# Altium schematic sheet PROC106B_PMIC.SchDoc: PMIC
size 431 x 279 mm; Date: Not shown in title block; ApprovedBy: Not shown in title block; CheckedBy: Not shown in title block; Author: Not shown in title block; CompanyName: Not shown in title block; DrawnBy: Antony/Anand Ram; Engineer: Not shown in title block; Organization: Not shown in title block; Address1: Not shown in title block; Address2: Not shown in title block; Address3: Not shown in title block; Address4: Not shown in title block; DocumentNumber: 5; Revision: Use project parameter SCH_Rev; SheetNumber: 5; SheetTotal: 12; PageSetup: Record=PageOptions|CenterHorizontal=True|CenterVertical=True|PrintScale=1.00|XCorrection=1.00|YCorrection=1.00|PrintKind=0|BorderSize=5000000|LeftOffset=0|BottomOffset=0|Orientation=2|PaperLength=1000|PaperWidth=1000|Scale=100|PaperSource=15|PrintQuality=600|MediaType=1|DitherType=10|PaperKind=Letter|PrintScaleMode=1; CurrentTime: Not shown in title block; CurrentDate: Not shown in title block; Time: Not shown in title block; DocumentFullPathAndName: Not shown in title block; DocumentName: Not shown in title block; ModifiedDate: Not shown in title block; ImagePath: Not shown in title block
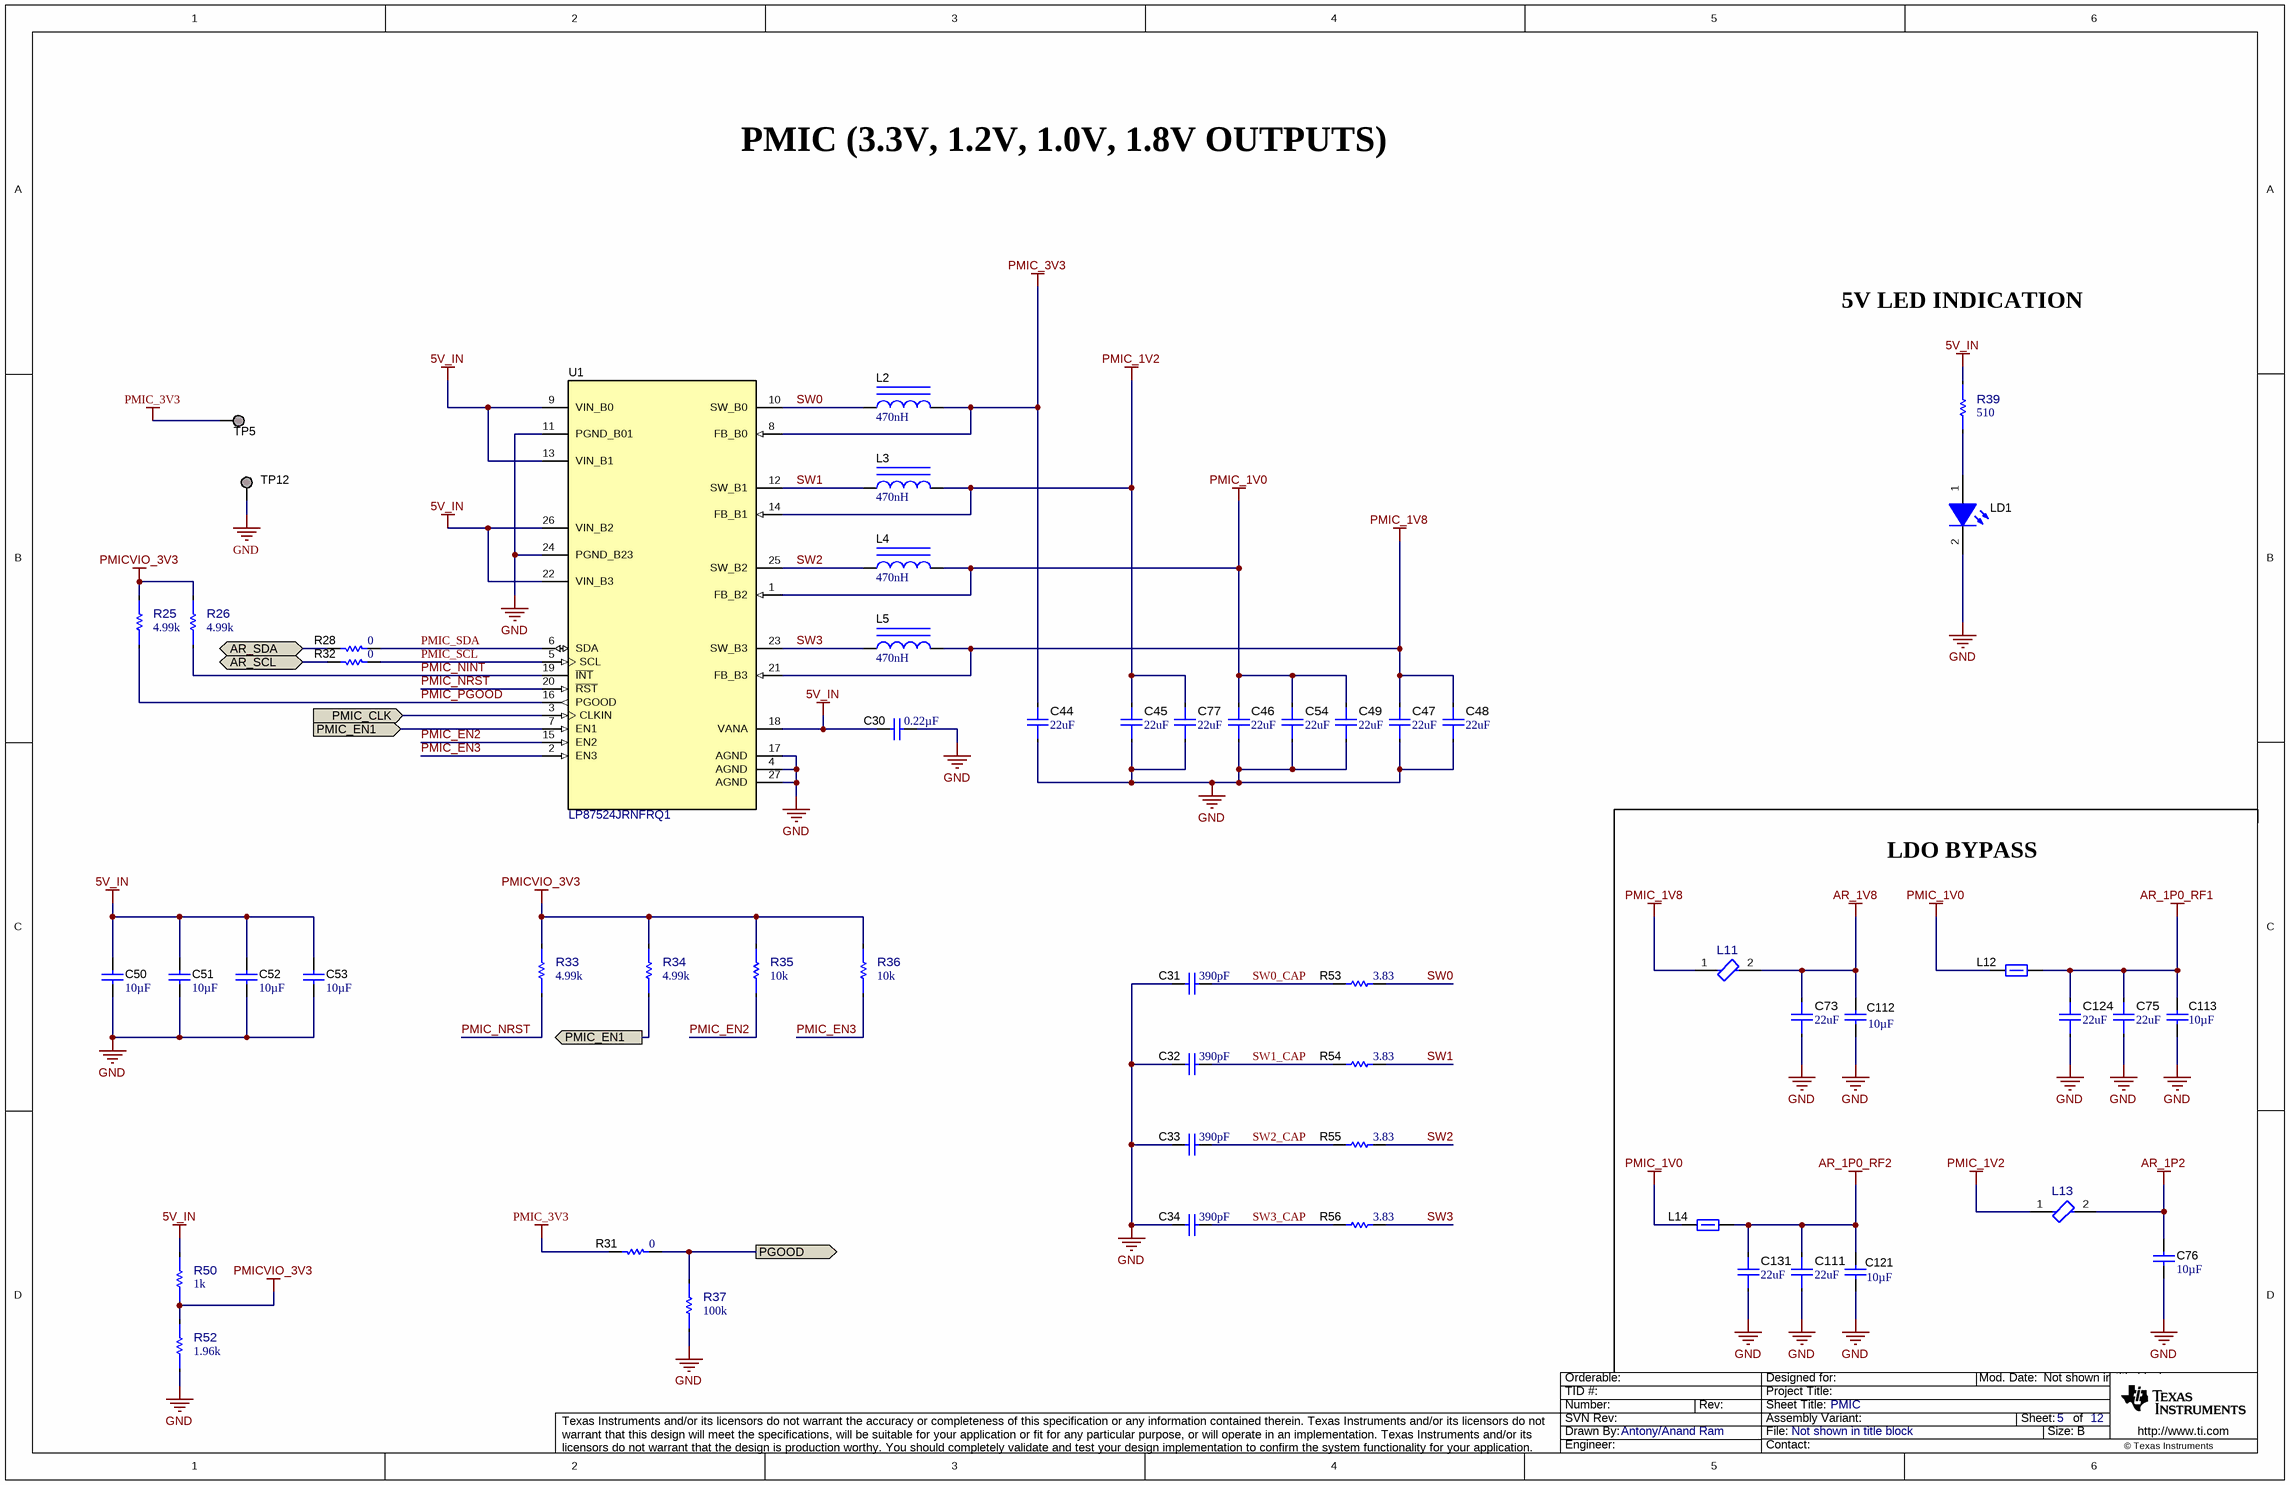
[diagram p0: PROC106B_PMIC.SchDoc]

## Parts
C30  ValueDisplayed: 0.22µF  [0402L]  (hidden comment: GCM155R71C224KE02D)
C31  ValueDisplayed: 390pF  [0402L]  (hidden comment: CGA2B2C0G1H391J050BA)
C32  ValueDisplayed: 390pF  [0402L]  (hidden comment: CGA2B2C0G1H391J050BA)
C33  ValueDisplayed: 390pF  [0402L]  (hidden comment: CGA2B2C0G1H391J050BA)
C34  ValueDisplayed: 390pF  [0402L]  (hidden comment: CGA2B2C0G1H391J050BA)
C44  ValueDisplayed: 22uF  [FP-CGA4J1X7T0J226M125AC_0805-MFG]  (hidden comment: CGA4J1X7T0J226M125AC)
C45  ValueDisplayed: 22uF  [FP-CGA4J1X7T0J226M125AC_0805-MFG]  (hidden comment: CGA4J1X7T0J226M125AC)
C46  ValueDisplayed: 22uF  [FP-CGA4J1X7T0J226M125AC_0805-MFG]  (hidden comment: CGA4J1X7T0J226M125AC)
C47  ValueDisplayed: 22uF  [FP-CGA4J1X7T0J226M125AC_0805-MFG]  (hidden comment: CGA4J1X7T0J226M125AC)
C48  ValueDisplayed: 22uF  [FP-CGA4J1X7T0J226M125AC_0805-MFG]  (hidden comment: CGA4J1X7T0J226M125AC)
C49  ValueDisplayed: 22uF  [FP-CGA4J1X7T0J226M125AC_0805-MFG]  (hidden comment: CGA4J1X7T0J226M125AC)
C50  Cap_F: 10µF  [0805_HV1]  (hidden comment: GCM21BR71A106KE22L)
C51  Cap_F: 10µF  [0805_HV1]  (hidden comment: GCM21BR71A106KE22L)
C52  Cap_F: 10µF  [0805_HV1]  (hidden comment: GCM21BR71A106KE22L)
C53  Cap_F: 10µF  [0805_HV1]  (hidden comment: GCM21BR71A106KE22L)
C54  ValueDisplayed: 22uF  [FP-CGA4J1X7T0J226M125AC_0805-MFG]  (hidden comment: CGA4J1X7T0J226M125AC)
C73  ValueDisplayed: 22uF  [FP-CGA4J1X7T0J226M125AC_0805-MFG]  (hidden comment: CGA4J1X7T0J226M125AC)
C75  ValueDisplayed: 22uF  [FP-CGA4J1X7T0J226M125AC_0805-MFG]  (hidden comment: CGA4J1X7T0J226M125AC)
C76  Cap_F: 10µF  [0805L]  (hidden comment: GCM21BR71A106KE22L)
C77  ValueDisplayed: 22uF  [FP-CGA4J1X7T0J226M125AC_0805-MFG]  (hidden comment: CGA4J1X7T0J226M125AC)
C111  ValueDisplayed: 22uF  [FP-CGA4J1X7T0J226M125AC_0805-MFG]  (hidden comment: CGA4J1X7T0J226M125AC)
C112  Cap_F: 10µF  [0805L]  (hidden comment: GCM21BR71A106KE22L)
C113  Cap_F: 10µF  [0805L]  (hidden comment: GCM21BR71A106KE22L)
C121  Cap_F: 10µF  [0805L]  (hidden comment: GCM21BR71A106KE22L)
C124  ValueDisplayed: 22uF  [FP-CGA4J1X7T0J226M125AC_0805-MFG]  (hidden comment: CGA4J1X7T0J226M125AC)
C131  ValueDisplayed: 22uF  [FP-CGA4J1X7T0J226M125AC_0805-MFG]  (hidden comment: CGA4J1X7T0J226M125AC)
L2  ValueDisplayed: 470nH  [DFE252012P]  (hidden comment: DFE252012PD-R47M)
L3  ValueDisplayed: 470nH  [DFE252012P]  (hidden comment: DFE252012PD-R47M)
L4  ValueDisplayed: 470nH  [DFE252012P]  (hidden comment: DFE252012PD-R47M)
L5  ValueDisplayed: 470nH  [DFE252012P]  (hidden comment: DFE252012PD-R47M)
L11  MPZ2012S101ATD25  [FP-MPZ2012S101ATD25_0805-MFG]  (value not drawn)
L12  BLM18KG121TH1D  [0603_HV]  (value not drawn)
L13  MPZ2012S101ATD25  [FP-MPZ2012S101ATD25_0805-MFG]  (value not drawn)
L14  BLM18KG121TH1D  [0603_HV]  (value not drawn)
LD1  APHHS1005CGCK  [APHHS1005_Green]  (value not drawn)
R25  value 4.99k  [FP-ERJ-1GNF4991C_0201-IPC_C]  (hidden comment: ERJ-1GNF4991C)
R26  value 4.99k  [FP-ERJ-1GNF4991C_0201-IPC_C]  (hidden comment: ERJ-1GNF4991C)
R28  ValueDisplayed: 0  [0201L]  (hidden comment: ERJ-1GN0R00C)
R31  ValueDisplayed: 0  [0201L]  (hidden comment: ERJ-1GN0R00C)
R32  ValueDisplayed: 0  [0201L]  (hidden comment: ERJ-1GN0R00C)
R33  value 4.99k  [FP-ERJ-1GNF4991C_0201-IPC_C]  (hidden comment: ERJ-1GNF4991C)
R34  value 4.99k  [FP-ERJ-1GNF4991C_0201-IPC_C]  (hidden comment: ERJ-1GNF4991C)
R35  value 10k  [FP-ERA-1AEB103C_0201-IPC_C]  (hidden comment: ERA-1AEB103C)
R36  value 10k  [FP-ERA-1AEB103C_0201-IPC_C]  (hidden comment: ERA-1AEB103C)
R37  value 100k  [FP-ERJ-1GNF1003C_0201-IPC_C]  (hidden comment: ERJ-1GNF1003C)
R39  value 510  [FP-ERJ-1GNJ511C_0201-IPC_C]  (hidden comment: ERJ-1GNJ511C)
R50  value 1k  [FP-ERJ-1GNJ102C_0201-IPC_C]  (hidden comment: ERJ-1GNJ102C)
R52  value 1.96k  [FP-ERJ-1GNF1961C_0201-IPC_C]  (hidden comment: ERJ-1GNF1961C)
R53  ValueDisplayed: 3.83  [0402L]  (hidden comment: CRCW04023R83FKED)
R54  ValueDisplayed: 3.83  [0402L]  (hidden comment: CRCW04023R83FKED)
R55  ValueDisplayed: 3.83  [0402L]  (hidden comment: CRCW04023R83FKED)
R56  ValueDisplayed: 3.83  [0402L]  (hidden comment: CRCW04023R83FKED)
TP5  TESTPOINT  [TP_25MIL-SMT]  (value not drawn)  (no BOM)
TP12  TESTPOINT  [TP_VIA_060RND040]  (value not drawn)  (no BOM)
U1  LP87524JRNFRQ1  [RNF0026C]

## Ports
AR_SCL (bidir), AR_SDA (bidir), PGOOD (out), PMIC_CLK (in), PMIC_EN1 (in), PMIC_EN1 (out)

## Nets
5V_IN: C30.1 C50.1 C51.1 C52.1 C53.1 R39.1 R50.2 U1.9(VIN_B0) U1.13(VIN_B1) U1.18(VANA) U1.22(VIN_B3) U1.26(VIN_B2)
AR_1P0_RF1: C75.2 C113.1 C124.2 L12.2
AR_1P0_RF2: C111.2 C121.1 C131.2 L14.2
AR_1P2: C76.1 L13.2
AR_1V8: C73.2 C112.1 L11.2
GND: C30.2 C31.2 C32.2 C33.1 C34.1 C44.1 C45.1 C46.1 C47.1 C48.1 C49.1 C50.2 C51.2 C52.2 C53.2 C54.1 C73.1 C75.1 C76.2 C77.1 C111.1 C112.2 C113.2 C121.2 C124.1 C131.1 LD1.2(K) R37.1 R52.1 TP12.1 U1.4(AGND) U1.11(PGND_B01) U1.17(AGND) U1.24(PGND_B23) U1.27(AGND)
PMIC_1V0: C46.2 C49.2 C54.2 L4.1 L12.1 L14.1 U1.1(FB_B2)
PMIC_1V2: C45.2 C77.2 L3.1 L13.1 U1.14(FB_B1)
PMIC_1V8: C47.2 C48.2 L5.1 L11.1 U1.21(FB_B3)
PMIC_3V3: C44.2 L2.1 R31.1 TP5.1 U1.8(FB_B0)
PMICVIO_3V3: R25.2 R26.2 R33.2 R34.2 R35.2 R36.2 R50.1 R52.2
AR_SCL: R32.1 ; port AR_SCL
AR_SDA: R28.1 ; port AR_SDA
PGOOD: R31.2 R37.2 ; port PGOOD
PMIC_CLK: U1.3(CLKIN) ; port PMIC_CLK
PMIC_EN1: R34.1 U1.7(EN1) ; port PMIC_EN1
PMIC_EN2: R35.1 U1.15(EN2)
PMIC_EN3: R36.1 U1.2(EN3)
PMIC_NINT: R26.1 U1.19(~{INT})
PMIC_NRST: R33.1 U1.20(~{RST})
PMIC_PGOOD: R25.1 U1.16(PGOOD)
PMIC_SCL: R32.2 U1.5(SCL)
PMIC_SDA: R28.2 U1.6(SDA)
SW0: L2.2 R53.2 U1.10(SW_B0)
SW0_CAP: C31.1 R53.1
SW1: L3.2 R54.2 U1.12(SW_B1)
SW1_CAP: C32.1 R54.1
SW2: L4.2 R55.2 U1.25(SW_B2)
SW2_CAP: C33.2 R55.1
SW3: L5.2 R56.2 U1.23(SW_B3)
SW3_CAP: C34.2 R56.1
NetLD1_1: LD1.1(A) R39.2

## Notes on the sheet
- PMIC (3.3V, 1.2V, 1.0V, 1.8V OUTPUTS)
- 5V LED INDICATION
- LDO BYPASS
- Drawn By:
- SVN Rev:
- Number:
- TID #:
- Orderable:
- Rev:
- Sheet Title:
- File:
- Project Title:
- Designed for:
- Assembly Variant:
- Mod. Date:
- Sheet:
- Size:
- of
- B
- http://www.ti.com
- Texas Instruments and/or its licensors do not warrant the accuracy or completeness of this specification or any information contained therein. Texas Instruments and/or its licensors do not warrant that this design will meet the specifications, will be suitable for your application or fit for any particular purpose, or will operate in an implementation. Texas Instruments and/or its licensors do not warrant that the design is production worthy. You should completely validate and test your design implementation to confirm the system functionality for your application.
- Engineer:
- Contact:
- © Texas Instruments

## Library data of the parts
C30 = CMP-0078265-1: CAP, CERM, 0.22 µF, 16 V,+/- 10%, X7R, AEC-Q200 Grade 1, 0402; Manufacturer: MuRata; Value: 0.22uF; AEC Category: Q200; AEC Grade: 1; AEC Qualified: Y; Cap_Case: 0402; Cap_F: 220nF; Polarized: N; SizeArea_mm2: 0.5; SizeAreaWB_mm2: 3; SizeZ_mm: 0.6; TaMax_C: 125°C; TaMin_C: -55°C; U/M: EA; Value2: 16V; RoHS: Y; ComponentLink1Description: Datasheet link; ComponentLink1URL: http://psearch.en.murata.com/capacitor/product/GCM155R71C224KE02%23.pdf; CompType: Capacitor; MountType: SMT; PackageReference: 0402; PartNumber: GCM155R71C224KE02D; SizeX_mm: 1; SizeY_mm: 0.5; Supplier 1: Digi-Key; Supplier 2: Mouser; Supplier Part Number 1: 490-10671-1-ND; Supplier Part Number 2: 81-GCM155R71C224KE2D; Technology: Ceramic; TempCo: X7R; Tolerance_%: 10%; VDC_V: 16V
C31-C34 = CMP-0085511-1: CAP, CERM, 390 pF, 50 V,+/- 5%, C0G/NP0, AEC-Q200 Grade 1, 0402; Manufacturer: TDK; AEC Qualified: Y; SizeZ_mm: 0.6; VDC_V: 50V; AEC Category: Q200; AEC Grade: 1; Cap_Case: 0402; Polarized: N; SizeArea_mm2: 0.5; SizeAreaWB_mm2: 3; TaMax_C: 125°C; TaMin_C: -55°C; U/M: EA; Value: 390pF; RoHS: Y; Cap_F: 390pF; ComponentLink1Description: Datasheet link; ComponentLink1URL: https://product.tdk.com/en/search/capacitor/ceramic/mlcc/info?part_no=CGA2B2C0G1H391J050BA; PackageReference: 0402; PartNumber: CGA2B2C0G1H391J050BA; TempCo: C0G/NP0; Tolerance_%: 5%; CompType: Capacitor; MountType: SMT; SizeX_mm: 1; SizeY_mm: 0.5; Technology: Ceramic; Value2: 50V
C44-C49 C54 C73 C75 C77 C111 C124 C131 = CMP-0091983-1: 22µF ±20% 6.3V Ceramic Capacitor X7T 0805 (2012 Metric); Manufacturer: TDK; AEC Qualified: Yes; AEC Grade: Grade 1; TempCo: +22/-33%; SizeZ_mm: 1.55mm; Value: 22µF; ComponentLink1URL: https://product.tdk.com/en/search/capacitor/ceramic/mlcc/info?part_no=CGA4J1X7T0J226M125AC; VDC_V: 6.3V; Operating Temperature Range: -55°C to +125°C; Tolerance_%: 20%; Cap_F: 22µF; Digikey Part Number: 445-CGA4J1X7T0J226M125ACCT-ND; ComponentLink1Description: Datasheet; PackageReference: 0805; Part Number: CGA4J1X7T0J226M125AC; Temperature Characteristic: X7T; Mouser Part Number: 810-CGA4J1X7T0J226M1; helpURL: https://upverter.com/upn/revision/46804438864a26f0/; Supplier 2: Mouser; Supplier Part Number 1: 445-CGA4J1X7T0J226M125ACCT-ND; datasheet: https://product.tdk.com/en/search/capacitor/ceramic/mlcc/info?part_no=CGA4J1X7T0J226M125AC; Lead Free: Yes; RoHS: TRUE; PartNumber: CGA4J1X7T0J226M125AC; Supplier Part Number 2: 810-CGA4J1X7T0J226M1; Datasheet Path: datasheets/Cap-CGA4J1X7T0J226M125AC.pdf; Supplier 1: Digikey; Digikey Description: AUTOMOTIVE GRADE,0805,X7T,6.3V,2
C50-C53 C76 C112 C113 C121 = CMP-0008017-2: CAP, CERM, 10 uF, 10 V, +/- 10%, X7R, 0805; Manufacturer: MuRata; Value: 10uF; AEC Category: Q200; Cap_Case: 0805; Polarized: N; SizeArea_mm2: 2.5; SizeAreaWB_mm2: 6.75; SizeX_mm: 2; SizeY_mm: 1.25; SizeZ_mm: 1.45; TaMax_C: 125°C; TaMin_C: -55°C; U/M: EA; Value1: Unknown; Value2: 10V; RoHS: Y; AEC Qualified: ?; ComponentLink1Description: Datasheet link; ComponentLink1URL: http://www.murata.com/products/catalog/pdf/c03e.pdf; CompType: Capacitor; MountType: SMT; PackageReference: 0805; PartNumber: GCM21BR71A106KE22L; Supplier 1: Digi-Key; Supplier 2: Newark; Supplier 3: Mouser; Supplier Part Number 1: 490-10674-1-ND; Supplier Part Number 2: 06AC6014; Supplier Part Number 3: 81-GCM21BR71A106KE2L; Technology: Ceramic; TempCo: X7R; Tolerance_%: 10%; ValueDisplayed: 10uF; VDC_V: 10V; LatestRevisionDate: 2017-03-09; Published: 2008-06-19; Publisher: Texas Instruments
L2-L5 = CMP-0058944-1: Inductor, Shielded, 470 nH, 4.7 A, 0.021 ohm, SMD; Manufacturer: MuRata Toko; DCR_ohm: 0.021; Irms: 4.7A @ 40C rise; Isat: 6.1A @ 30% inductance drop; SizeZ_mm: 1.2; AEC Category: Q200; Imax_A: 4.7A; SizeArea_mm2: 5; SizeAreaWB_mm2: 10.5; SizeX_mm: 2.5; SizeY_mm: 2; Value: 470nH; RoHS: Y; AEC Qualified: ?; ComponentLink1Description: Datasheet link; ComponentLink1URL: https://sps06.itg.ti.com/sites/KMS/crossdivteams/altium/docs/ComponentDatasheets/DFE252012PD_Catalouge_20140701 with AEC-Q200.pdf; Ind_H: 470nH; Material: ?; PackageReference: 1008; PartNumber: DFE252012PD-R47M; Technology: Shielded; CompType: Inductor; LatestRevisionDate: 2017-06-02; MountType: SMT; Published: 2008-06-26; Publisher: Texas Instruments; Value1: 0.021 ohm; Value2: 4.7A
L11 L13 = CMP-0089947-1: 100 Ohms @ 100MHz 1 Power Line Ferrite Bead 0805 (2012 Metric) 4A 20mOhm; Manufacturer: TDK; DCR_ohm: 0.02; SizeZ_mm: 1.05mm; AEC Grade: Grade 1; AEC Qualified: Yes; Impedance At Frequency: 100Ω @ 100MHz; Tolerance_%: 25%; ComponentLink1URL: https://product.tdk.com/info/en/catalog/datasheets/beads_automotive_power_mpz2012_en.pdf; Supplier Part Number 2: 810-MPZ2012S101ATD25; Supplier 2: Mouser; RoHS: TRUE; Supplier 1: Digikey; PackageReference: 0805; Imax_A: 4A; PartNumber: MPZ2012S101ATD25; ComponentLink1Description: Datasheet; Supplier Part Number 1: 445-172903-1-ND; datasheet: https://product.tdk.com/info/en/catalog/datasheets/beads_automotive_power_mpz2012_en.pdf; Datasheet Path: datasheets/FBead-MPZ2012S101ATD25.pdf; Digikey Description: FERRITE BEAD 100 OHM 0805 1LN; Digikey Part Number: 445-172903-1-ND; helpURL: https://upverter.com/upn/revision/572b4800072287ce/; Lead Free: Yes; Material: Ferrite; Mouser Description: Ferrite Beads 0805 100ohms@100MHz 4.0A AEC-Q200; Mouser Part Number: 810-MPZ2012S101ATD25; Operating Temperature Range: -55°C to +125°C; Part Number: MPZ2012S101ATD25; Test Frequency: 100MHz
L12 L14 = CMP-0077879-1: Ferrite Bead, 120 ohm @ 100 MHz, 1.9 A, 0603; Manufacturer: MuRata; ZTyp@100MHz_Ohm: 120; SizeAreaWB_mm2: 4.68; DCR_ohm: 0.04; Value1: 0.04 ohm; Value: 120 ohm; Imax_A: 1.9A; SizeZ_mm: 1.0; SizeX_mm: 1.6; SizeY_mm: 0.8; SizeArea_mm2: 1.28; ComponentLink1URL: http://www.murata.com/en-global/products/productdata/8796737273886/QNFA9101.pdf; Supplier Part Number 2: 81-BLM18KG121TH1D; Supplier 2: Mouser; RoHS: Y; MountType: SMT; Supplier 1: Digi-Key; PackageReference: 0603; Value2: 1.9A; CompType: Ferrite Bead; PartNumber: BLM18KG121TH1D; ComponentLink1Description: Datasheet link; Supplier Part Number 1: 490-13261-1-ND; ValueDisplayed: 120 ohm
LD1 = CMP-0067682-2: LED, Green, SMD; Manufacturer: Kingbright; Angle: 120.0; Power_TotalModule: 75mW; SizeZ_mm: 0.6; Vf_V: 2.1V; Vr_V: 5V; Io_A: 20mA; Ir_A: 10µA; SizeArea_mm2: 0.5; SizeAreaWB_mm2: 3.0; SizeX_mm: 1.0; Tjmax_C: 85°C; Value1: 0.075W; RoHS: Y; Color: Green; ComponentLink1Description: Datasheet link; ComponentLink1URL: http://www.kingbrightusa.com/images/catalog/SPEC/APHHS1005CGCK.pdf; PackageReference: 0402; PartNumber: APHHS1005CGCK; CompType: LED; MountType: SMT; SizeY_mm: 0.5; Type: ?; Value2: 2.1V; Value: Green
R25 R26 R33 R34 = CMP-0090497-1: 4.99 kOhms ±1% 0.05W, 1/20W Chip Resistor 0201 (0603 Metric) Automotive AEC-Q200 Thick Film; Manufacturer: Panasonic Electronic Components; AEC Grade: Grade 1; AEC Qualified: Yes; Power_W: 50mW; SizeZ_mm: 0.26mm; TempCo: 200ppm/°C; VDC_V: 25V; RoHS: TRUE; ComponentLink1Description: Datasheet; ComponentLink1URL: https://industrial.panasonic.com/cdbs/www-data/pdf/RDA0000/AOA0000C304.pdf; PackageReference: 0201; PartNumber: ERJ-1GNF4991C; Res_ohm: 4.99k; Supplier 1: Digikey; Supplier 2: Mouser; Supplier Part Number 1: P123046CT-ND; Supplier Part Number 2: 667-ERJ-1GNF4991C; Technology: Thick Film; Tolerance_%: 1%; datasheet: https://industrial.panasonic.com/cdbs/www-data/pdf/RDA0000/AOA0000C304.pdf; Datasheet Path: datasheets/Res-ERJ-1GNF4991C.pdf; Digikey Description: RES SMD 4.99K OHM 1% 1/20W 0201; Digikey Part Number: P123046CT-ND; helpURL: https://upverter.com/upn/revision/2e32c60b077f8dd5/; Lead Free: Yes; Mouser Description: Thick Film Resistors - SMD 0201 4.99Kohm 1% HalogenFree AEC-Q200; Mouser Part Number: 667-ERJ-1GNF4991C; Operating Temperature Range: -55°C to +125°C; Part Number: ERJ-1GNF4991C; Series: ERJ
R28 R31 R32 = CMP-0065361-1: RES, 0, 5%, .05 W, AEC-Q200 Grade 0, 0201; Manufacturer: Panasonic; AEC Qualified: Y; Power_W: 50mW; SizeZ_mm: 0.26; TempCo: ppm/C; AEC Category: Q200; EIA_Code: E24; Green_Lifecycle: Not Set; Green_REACh: Incomplete; SizeArea_mm2: 0.18; SizeX_mm: 0.6; SizeY_mm: 0.3; U/M: EA; Value2: .05W; Value: 0; Value_Code: 0000; RoHS: Y; ComponentLink1Description: Datasheet link; ComponentLink1URL: https://industrial.panasonic.com/cdbs/www-data/pdf/RDA0000/AOA0000C281.pdf; PackageReference: 0201; PartNumber: ERJ-1GN0R00C; Res_ohm: 0; Technology: Thick Film; Tolerance_%: 5%; AEC Grade: 0; CompType: Resistor; Green_EU RoHS-2: Incomplete; Green_EU RoHS: Incomplete; LatestRevisionDate: 2017-06-05; MountType: SMT; Published: 2016-10-14; Publisher: Texas Instruments; Supplier 1: Digi-Key; Supplier 2: Newark; Supplier 3: Mouser; Supplier Part Number 1: P15979CT-ND; Supplier Part Number 2: 51W5934; Supplier Part Number 3: 667-ERJ-1GN0R00C; Value1: 5%
R35 R36 = CMP-0090084-1: RES SMD 10K OHM 0.1% 1/20W 0201; Manufacturer: Panasonic; AEC Qualified: No; Power_W: 50mW; SizeZ_mm: 0.26mm; TempCo: 25ppm/°C; VDC_V: 25V; RoHS: TRUE; ComponentLink1Description: Datasheet; ComponentLink1URL: https://industrial.panasonic.com/cdbs/www-data/pdf/RDM0000/AOA0000C307.pdf; PackageReference: 0201; PartNumber: ERA-1AEB103C; Res_ohm: 10k; Technology: Thin Film; Tolerance_%: 0.1%; datasheet: https://industrial.panasonic.com/cdbs/www-data/pdf/RDM0000/AOA0000C307.pdf; Datasheet Path: datasheets/Res-ERA-1AEB103C.pdf; Digikey Description: RES SMD 10K OHM 0.1% 1/20W 0201; Digikey Part Number: P10KBXCT-ND; helpURL: https://upverter.com/upn/revision/ad75fa42d92ba837/; Lead Free: Yes; Mouser Part Number: 667-ERA-1AEB103C; Operating Temperature Range: -55°C to +155°C; Part Number: ERA-1AEB103C; Series: ERA; Supplier 1: Digikey; Supplier 2: Mouser; Supplier Part Number 1: P10KBXCT-ND; Supplier Part Number 2: 667-ERA-1AEB103C
R37 = CMP-0090298-1: 100 kOhms ±1% 0.05W, 1/20W Chip Resistor 0201 (0603 Metric) Automotive AEC-Q200 Thick Film; Manufacturer: Panasonic Electronic Components; AEC Grade: Grade 1; AEC Qualified: Yes; Power_W: 50mW; SizeZ_mm: 0.26mm; TempCo: 200ppm/°C; VDC_V: 25V; RoHS: TRUE; ComponentLink1Description: Datasheet; ComponentLink1URL: https://industrial.panasonic.com/cdbs/www-data/pdf/RDA0000/AOA0000C304.pdf; PackageReference: 0201; PartNumber: ERJ-1GNF1003C; Res_ohm: 100k; Supplier 1: Digikey; Supplier 2: Mouser; Supplier Part Number 1: P122655CT-ND; Supplier Part Number 2: 667-ERJ-1GNF1003C; Technology: Thick Film; Tolerance_%: 1%; datasheet: https://industrial.panasonic.com/cdbs/www-data/pdf/RDA0000/AOA0000C304.pdf; Datasheet Path: datasheets/Res-ERJ-1GNF1003C.pdf; Digikey Description: RES SMD 100K OHM 1% 1/20W 0201; Digikey Part Number: P122655CT-ND; helpURL: https://upverter.com/upn/revision/52b354a5d57be433/; Lead Free: Yes; Mouser Description: Thick Film Resistors 0201 100Kohm 1% HalogenFree AEC-Q200; Mouser Part Number: 667-ERJ-1GNF1003C; Operating Temperature Range: -55°C to +125°C; Part Number: ERJ-1GNF1003C; Series: ERJ
R39 = CMP-0090502-1: 510 Ohms ±5% 0.05W, 1/20W Chip Resistor 0201 (0603 Metric) Automotive AEC-Q200 Thick Film; Manufacturer: Panasonic Electronic Components; AEC Grade: Grade 1; AEC Qualified: Yes; Power_W: 50mW; SizeZ_mm: 0.26mm; TempCo: 200ppm/°C; VDC_V: 25V; RoHS: TRUE; ComponentLink1Description: Datasheet; ComponentLink1URL: https://industrial.panasonic.com/cdbs/www-data/pdf/RDA0000/AOA0000C301.pdf; PackageReference: 0201; PartNumber: ERJ-1GNJ511C; Res_ohm: 510; Supplier 1: Digikey; Supplier 2: Mouser; Supplier Part Number 1: P123339CT-ND; Supplier Part Number 2: 667-ERJ-1GNJ511C; Technology: Thick Film; Tolerance_%: 5%; datasheet: https://industrial.panasonic.com/cdbs/www-data/pdf/RDA0000/AOA0000C301.pdf; Datasheet Path: datasheets/Res-ERJ-1GNJ511C.pdf; Digikey Description: RES SMD 510 OHM 5% 1/20W 0201; Digikey Part Number: P123339CT-ND; helpURL: https://upverter.com/upn/revision/5c2df3b7f61172b7/; Lead Free: Yes; Mouser Description: Res Thick Film 0201 510 Ohm 5% 0.05W(1/20W) ±200ppm/C Pad SMD Automotive T/R; Mouser Part Number: 667-ERJ-1GNJ511C; Operating Temperature Range: -55°C to +125°C; Part Number: ERJ-1GNJ511C; Series: ERJ
R50 = CMP-0090500-1: 1 kOhms ±5% 0.05W, 1/20W Chip Resistor 0201 (0603 Metric) Automotive AEC-Q200 Thick Film; Manufacturer: Panasonic Electronic Components; AEC Grade: Grade 1; AEC Qualified: Yes; Power_W: 50mW; SizeZ_mm: 0.26mm; TempCo: 200ppm/°C; VDC_V: 25V; RoHS: TRUE; ComponentLink1Description: Datasheet; ComponentLink1URL: http://industrial.panasonic.com/www-cgi/jvcr13pz.cgi?E+PZ+3+AOA0002+ERJ1GNJ102C+7+WW; PackageReference: 0201; PartNumber: ERJ-1GNJ102C; Res_ohm: 1k; Supplier 1: Digikey; Supplier 2: Mouser; Supplier Part Number 1: P123221CT-ND; Supplier Part Number 2: 667-ERJ-1GNJ102C; Technology: Thick Film; Tolerance_%: 5%; datasheet: http://industrial.panasonic.com/www-cgi/jvcr13pz.cgi?E+PZ+3+AOA0002+ERJ1GNJ102C+7+WW; Datasheet Path: datasheets/Res-ERJ-1GNJ102C.pdf; Digikey Description: RES SMD 1K OHM 5% 1/20W 0201; Digikey Part Number: P123221CT-ND; helpURL: https://upverter.com/upn/revision/53a311929d77a537/; Lead Free: Yes; Mouser Description: Thick Film Resistors - SMD 0201 1Kohm 5% HalogenFree AEC-Q200; Mouser Part Number: 667-ERJ-1GNJ102C; Operating Temperature Range: -55°C to +125°C; Part Number: ERJ-1GNJ102C; Series: ERJ
R52 = CMP-0090496-1: Res Thick Film 0201 1.96K Ohm 1% 1/20W 200ppm/C Molded SMD T/R; Manufacturer: Panasonic; AEC Grade: Grade 1; AEC Qualified: Yes; Power_W: 50mW; SizeZ_mm: 0.26mm; TempCo: 200ppm/°C; VDC_V: 25V; RoHS: TRUE; ComponentLink1Description: Datasheet; ComponentLink1URL: https://industrial.panasonic.com/cdbs/www-data/pdf/RDA0000/AOA0000C304.pdf; PackageReference: 0201; PartNumber: ERJ-1GNF1961C; Res_ohm: 1.96k; Supplier 1: Digikey; Supplier 2: Mouser; Supplier Part Number 1: P122807CT-ND; Supplier Part Number 2: 667-ERJ-1GNF1961C; Technology: Thick Film; Tolerance_%: 1%; datasheet: https://industrial.panasonic.com/cdbs/www-data/pdf/RDA0000/AOA0000C304.pdf; Datasheet Path: datasheets/Res-ERJ-1GNF1961C.pdf; Digikey Description: RES SMD 1.96K OHM 1% 1/20W 0201; Digikey Part Number: P122807CT-ND; helpURL: https://upverter.com/upn/revision/9b6026d5b91f25ae/; Lead Free: Yes; Mouser Description: Res Thick Film 0201 1.96K Ohm 1% 0.05W ±200ppm/°C Molded SMD T/R; Mouser Part Number: 667-ERJ-1GNF1961C; Operating Temperature Range: -55°C to +125°C; Part Number: ERJ-1GNF1961C; Series: ERJ
R53-R56 = CMP-0026363-2: RES, 3.83, 1%, 0.063 W, AEC-Q200 Grade 0, 0402; Manufacturer: Vishay-Dale; TempCo: 100 ppm/C; AEC Qualified: Y; Power_W: 63mW; VDC_V: 50V; SizeZ_mm: 0.6; AEC Category: Q200; AEC Grade: 0; EIA_Code: E96; SizeArea_mm2: 0.5; SizeX_mm: 1; Value2: 0.063W; Value: 3.83; Value_Code: 3R83; ComponentLink1Description: Datasheet link; PackageReference: 0402; RoHS: E; Technology: Thick Film; PartNumber: CRCW04023R83FKED; ComponentLink1URL: http://www.vishay.com/docs/20035/dcrcwe3.pdf; Res_ohm: 3.83; Tolerance_%: 1%; CompType: Resistor; MountType: SMT; SizeY_mm: 0.5; Supplier 1: Digi-Key; Supplier 2: Mouser; Supplier Part Number 1: 541-3.83LLCT-ND; Supplier Part Number 2: 71-CRCW04023R83FKED; Value1: 1%
TP5 TP12 = CMP-0078143-3: TEST POINT.  No entry in BOM.; CompType: Testpoint; Manufacturer: N/A; PackageReference: N/A; PartNumber: N/A; Library Reference: TESTPOINT
U1 = CMP-0079120-2: 4-A + 2.5-A + Two 1.5-A Buck Converters With Integrated Switches, RNF0026C (VQFN-HR-26); Alternate PartNumber: LP87524JRNFTQ1; Alternate Manufacturer: Texas Instruments; SizeAreaWB_mm2: 27.5; SizeZ_mm: 0.9; SizeX_mm: 4; SizeY_mm: 4.5; SizeArea_mm2: 18; CompType: IC; AEC Qualified: Y; AEC Category: Q200; ComponentLink1URL: http://www.ti.com/lit/ds/symlink/lp87524-q1.pdf; PackageDescription: VQFN-HR-26; RoHS: Y; MountType: SMT; ComponentLink2URL: http://www.ti.com/product/lp87524-q1; ComponentLink2Description: Product Folder; Manufacturer: Texas Instruments; PackageReference: RNF0026C; ComponentLink1Description: Datasheet Link; PartNumber: LP87524JRNFRQ1